# EasyEDA Pro project 22180210-王泽万-项目七.epro

# Schematic Schematic1
Create Date: 2024-05-23; Page Name: P1; Project Name: 项目七金属探测仪; Schematic Name: Schematic1; Update Date: 2024-05-23; Company: 22电子1; Drawed: 22180210王泽万; Page Size: A4; Version: V1.0
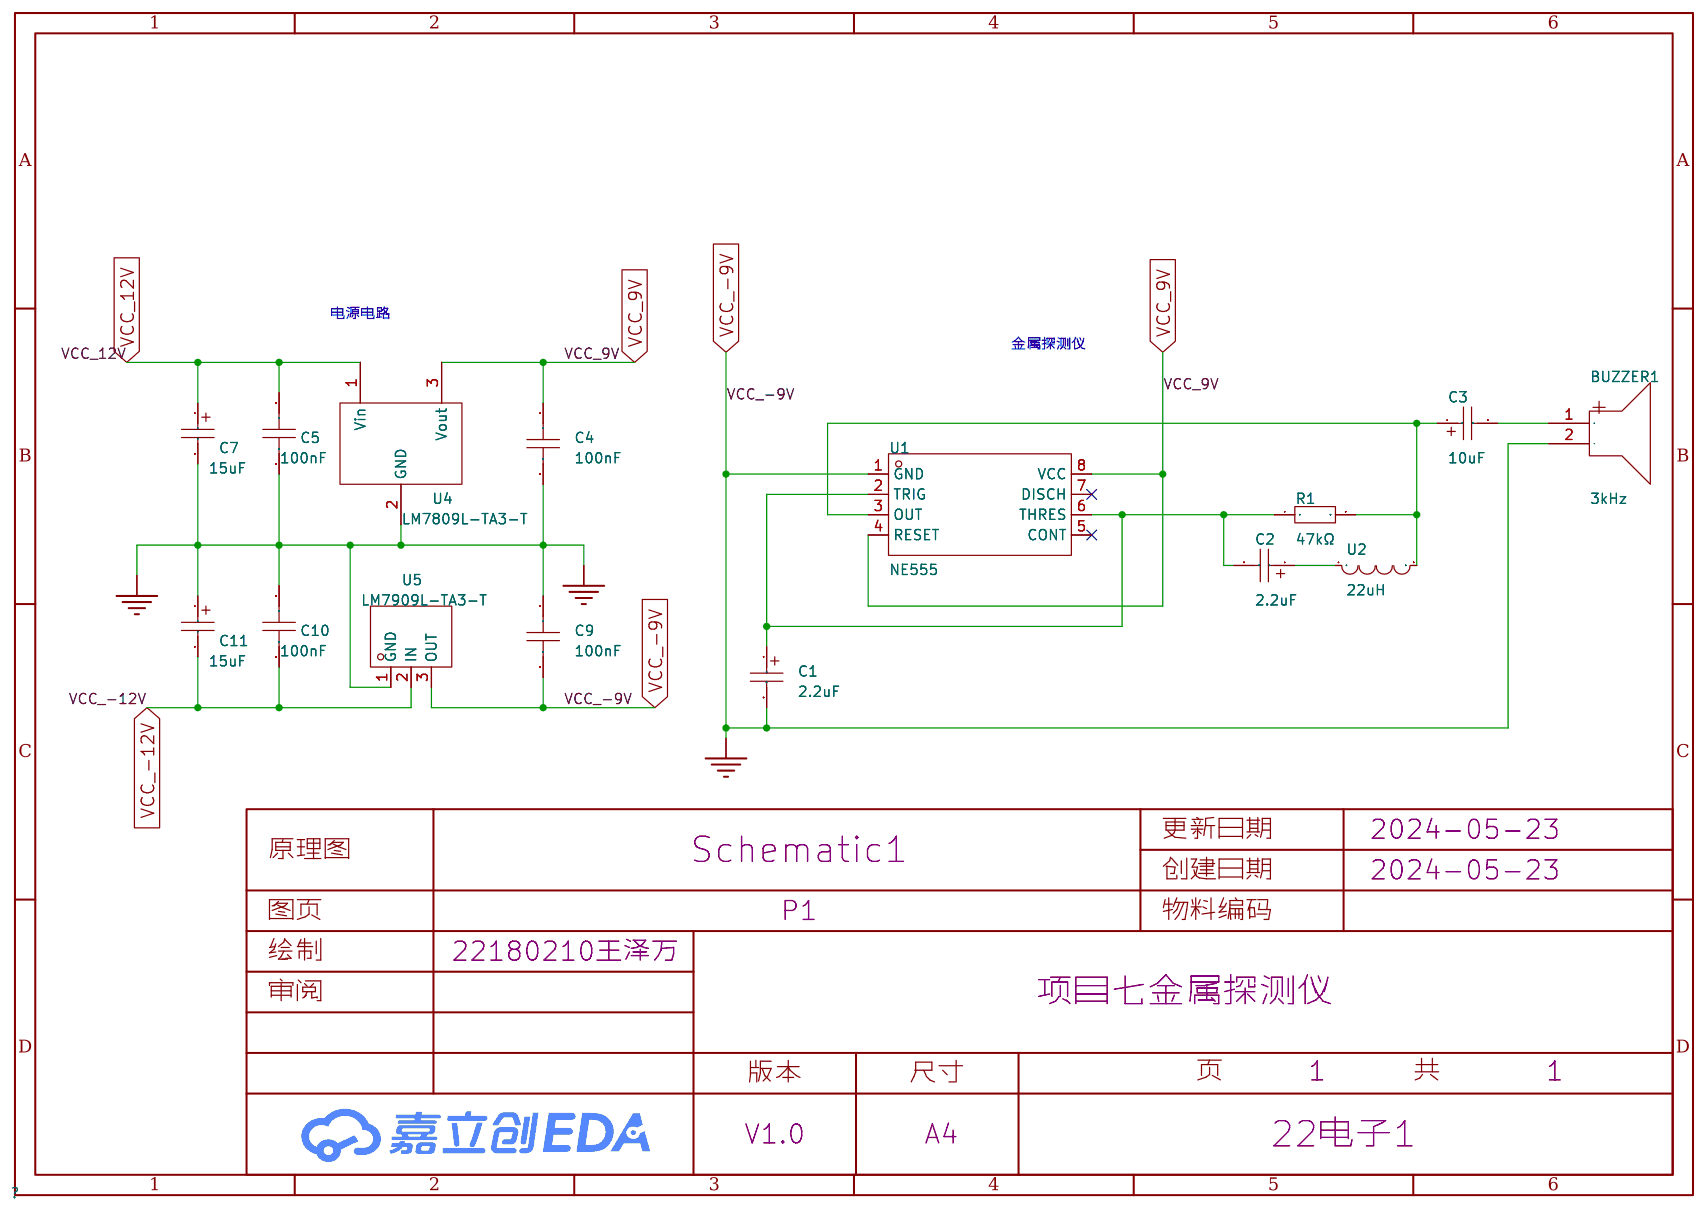
[diagram p0: schematic sheet]

## Parts
BUZZER1  3kHz  [BUZ-TH_BD9.0-P5.00-D0.6-FD]
C1  2.2uF  [C_Ele_SMD_3x5.4mm]
C2  2.2uF  [C_Ele_SMD_3x5.4mm]
C3  10uF  [C_Ele_SMD_3x5.4mm]
C4  100nF  [C0603]
C5  100nF  [C0603]
C7  15uF  [C_Ele_SMD_3x5.4mm]
C9  100nF  [C0603]
C10  100nF  [C0603]
C11  15uF  [C_Ele_SMD_3x5.4mm]
R1  47kΩ  [R0603]
U1  NE555  [SOP-8_L5.0-W4.0-P1.27-LS6.0-BL]
U2  22uH  [IND-TH_L16.5-W8.5-P11.00-D1.0]
U4  LM7809L-TA3-T  [TO-220-3_L10.0-W4.5-P2.54-L]
U5  LM7909L-TA3-T  [TO-220-3_L10.0-W4.5-P2.54-L]

## Library data of the parts
BUZZER1 = HNB09A03: 驱动方式:有源(内含驱动线路);构造类型:电磁式;频率:3kHz;声压(SPL):85dB@10cm;; LCSC Part Name: 电磁式有源一体蜂鸣器HNB09A03; Supplier Part: C96102; Manufacturer: 华能; Supplier Footprint: 插件,D=9mm; Datasheet: https://atta.szlcsc.com/upload/public/pdf/source/20170522/1495448326172.pdf; Supplier: LCSC; Oscillator Circuit: 有源(内含驱动线路); Technology Type: 电磁式; Operating Voltage: 1.5V~4.5V; Current Consumption: 30mA; Sound Pressure Level (SPL): 85dB@10cm; Diameter (φD): 9mm; Height: 5.5mm; Operating Temperature: -20℃~+70℃
C1-C3 C7 C11 = C_Ele_SMD_3x5.4mm: Supplier Footprint: SMD,3x5.4mm
C4 C5 C9 C10 = C0603X104K050T: 容值:100nF;精度:±10%;额定电压:50V;材质(温度系数):X7R;; LCSC Part Name: 100nF ±10% 50V; Supplier Part: C187860; Manufacturer: IHHEC(禾伸堂); Supplier Footprint: 0603; JLCPCB Part Class: Extended Part; Datasheet: https://atta.szlcsc.com/upload/public/pdf/source/20180316/B1A881EE882D7AA2911761F448C7BFE2.pdf; Supplier: LCSC; Tolerance: ±10%; Voltage Rated: 50V; Temperature Coefficient: X7R
R1 = 0603WAF4702T5E: 电阻类型:厚膜电阻;阻值:47kΩ;精度:±1%;功率:100mW;最大工作电压:75V;温度系数:±100ppm/℃;; LCSC Part Name: 47kΩ ±1% 100mW 厚膜电阻; Supplier Part: C25819; Manufacturer: UNI-ROYAL(厚声); Supplier Footprint: 0603; Datasheet: https://atta.szlcsc.com/upload/public/pdf/source/20200306/C422600_1E6D84923E4A46A82E41ADD87F860B5C.pdf; Supplier: LCSC; Type: 厚膜电阻; Tolerance: ±1%; Power(Watts): 100mW; Overload Voltage (Max): 75V; Temperature Coefficient: ±100ppm/℃; Operating Temperature Range: -55℃~+155℃
U1 = NE555: Supplier Part: C504549; Supplier Footprint: SOP-8-4.0mm; JLCPCB Part Class: 扩展库; Supplier: LCSC
U2 = SLT050125T220MUB: 电感值:22uH;精度:±20%;额定电流:5A;饱和电流(Isat):-;类型:磁环电感;Q值:-;; LCSC Part Name: 磁环电感 22uH ±20%; Supplier Part: C326010; Manufacturer: Sunltech(韩国顺磁); Supplier Footprint: 插件; JLCPCB Part Class: 扩展库; Datasheet: https://atta.szlcsc.com/upload/public/pdf/source/20181114/C326010_3669DB49017440BC1576DBED373FE03D.pdf; Supplier: LCSC; Tolerance: ±20%; Rated Current: 5A; DC Resistance: 15mΩ; Type: 磁环电感
U4 = LM7809L-TA3-T: 输出类型:固定;最大输入电压:35V;输出电压:9V;最大输出电流:1A;输出极性:正极;; LCSC Part Name: 输入35V 输出9V 1A; Supplier Part: C75512; Manufacturer: UTC(友顺); Supplier Footprint: TO-220; Datasheet: https://atta.szlcsc.com/upload/public/pdf/source/20160620/1466410513906.pdf; Supplier: LCSC; Output Type: 固定; Maximum Input Voltage: 35V; Output Voltage: 9V; MAX Output Current: 1A; Dropout Voltage: 2V; Output Polarity: 正极; Number of Outputs: 1
U5 = LM7909L-TA3-T: 输出类型:固定;最大输入电压:26V;输出电压:9V;最大输出电流:1A;电源纹波抑制比(PSRR):60dB@(120Hz);输出极性:负极;; LCSC Part Name: 输入26V 输出9V 1A; Supplier Part: C427635; Manufacturer: UTC(友顺); Supplier Footprint: TO-220; Datasheet: https://atta.szlcsc.com/upload/public/pdf/source/20190918/C428906_939899B9567A2FBBAFCB1D90D2F04407.pdf; Supplier: LCSC; Output Type: 固定; Maximum Input Voltage: 26V; Output Voltage: 9V; MAX Output Current: 1A; Power Supply Rejection Ratio (PSRR): 60dB@(120Hz); Dropout Voltage: 2V@(1A); Output Polarity: 负极; Number of Outputs: 1

## Nets
GND: C4.2 C5.2 C7.2 C9.1 C10.1 C11.1 U4.2(GND) U5.1(GND)
VCC_9V: C4.1 U1.4(RESET) U1.8(VCC) U4.3(Vout)
VCC_12V: C5.1 C7.1 U4.1(Vin)
VCC_-9V: BUZZER1.2(-) C1.2 C9.2 U1.1(GND) U5.3(OUT)
VCC_-12V: C10.2 C11.2 U5.2(IN)
$1N653: BUZZER1.1(+) C3.2
$1N836: C2.1 U2.1
$1N860: C3.1 R1.2 U1.3(OUT) U2.2
$1N1027: C1.1 C2.2 R1.1 U1.2(TRIG) U1.6(THRES)

Not connected (* = marked no-connect by the designer): U1 5(CONT)* 7(DISCH)*

## Notes on the sheet
- 电源电路
- 金属探测仪

# Board PCB1
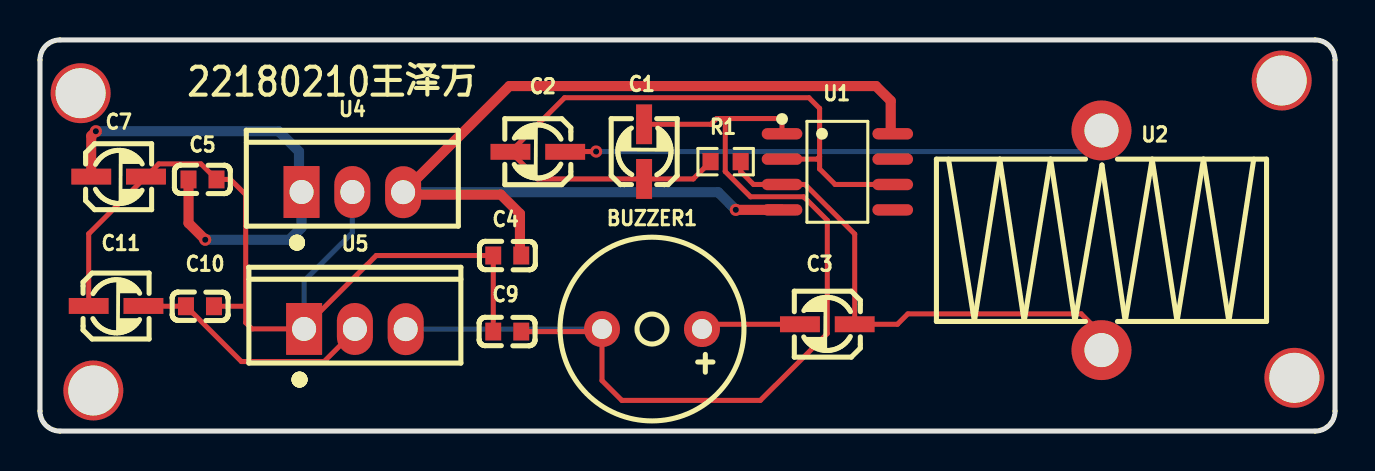
[diagram p1: board, top side]
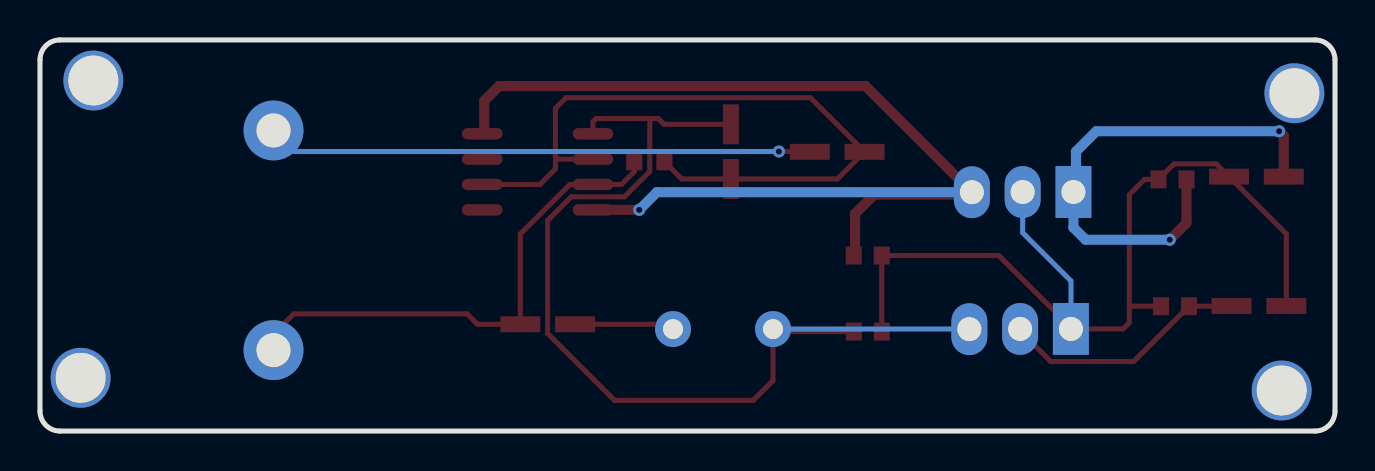
[diagram p2: board, bottom side, seen from below]

Outline 64.77 x 19.59 mm; copper layers: Top Layer, Bottom Layer. Coordinates in mm from the lower left corner of the outline.
Outline path: 0,18.59 0,1 arc(0.29,0.29) 1,0 63.77,0 arc(64.47,0.29) 64.77,1 64.77,18.59 arc(64.47,19.29) 63.77,19.59 1,19.59 arc(0.29,19.29) 0,18.59
Stack: Top Layer 0.035mm / Dielectric1 1.51mm FR4 er 4.5 / Bottom Layer 0.035mm

## Design rules (mm)
template: 自定义配置
spacing copperThickness1oz (default): track to track 0.102, other pairs 0.152 to 0.3
spacing copperThickness2oz: track to track 0.203, other pairs 0.152 to 0.3
track width copperThickness1oz (default): min 0.127, default 0.254, max 2.54
track width copperThickness2oz: min 0.203, default 0.254, max 2.54
track width VCC: min 0.127, default 0.508, max 2.54
differential pair differentialPair (default): width min 0.127, default 0.254, max 2.54; gap min 0.152, default 0.152
via viaSize (default): diameter min 0.5, default 0.61, max 10; hole min 0.3, default 0.305, max 6.299
net VCC_9V uses VCC
net VCC_12V uses VCC

## Placement (name value [footprint] x y rotation side)
BUZZER1  3kHz  [BUZ-TH_BD9.0-P5.00-D0.6-FD]  30.61 5.11 180 top
C1  2.2uF  [C_Ele_SMD_3x5.4mm]  30.23 14 270 top
C2  2.2uF  [C_Ele_SMD_3x5.4mm]  24.89 14 0 top
C3  10uF  [C_Ele_SMD_3x5.4mm]  39.37 5.36 0 top
C4  100nF  [C0603]  23.37 8.79 180 top
C5  100nF  [C0603]  8.13 12.6 0 top
C7  15uF  [C_Ele_SMD_3x5.4mm]  3.94 12.73 180 top
C9  100nF  [C0603]  23.37 4.98 0 top
C10  100nF  [C0603]  8 6.25 180 top
C11  15uF  [C_Ele_SMD_3x5.4mm]  3.81 6.25 180 top
NOREF  -  [Pad_e27]  2.03 16.92 0 top
NOREF#2  -  [Pad_e31]  62.1 17.55 270 top
NOREF#3  -  [Pad_e29]  2.67 2.03 90 top
NOREF#4  -  [Pad_e30]  62.73 2.67 180 top
R1  47kΩ  [R0603]  34.29 13.49 0 top
U1  NE555  [sop-8_l5.0-w4.0-p1.27-ls6.0-bl]  39.88 12.98 270 top
U2  22uH  [IND-TH_L16.5-W8.5-P11.00-D1.0]  53.09 9.55 270 top
U4  LM7809L-TA3-T  [TO-220-3_L10.0-W4.5-P2.54-L]  15.62 11.97 0 top
U5  LM7909L-TA3-T  [TO-220-3_L10.0-W4.5-P2.54-L]  15.75 5.11 0 top

## Footprints (pads in the part's own frame, mm; a bottom-side part is the same pattern mirrored in y, then rotated)
BUZ-TH_BD9.0-P5.00-D0.6-FD
  round 1.8 hole 1: 1(-2.5,0) 2(2.5,0)
C0603
  rect 0.8x0.9 smd: 1(-0.7,0) 2(0.7,0)
C_Ele_SMD_3x5.4mm
  rect 1.999x0.8 smd: 1(1.374,-0.014) 2(-1.364,-0.014)
IND-TH_L16.5-W8.5-P11.00-D1.0
  round 3 hole 1.7: 1(-5.5,0) 2(5.5,0)
Pad_e27
  round 3 hole 2.5: 9(0,0)
Pad_e29
  round 3 hole 2.5: 9(0,0)
Pad_e30
  round 3 hole 2.5: 9(0,0)
Pad_e31
  round 3 hole 2.5: 9(0,0)
R0603
  rect 0.806x0.864 smd: 1(-0.753,0) 2(0.753,0)
sop-8_l5.0-w4.0-p1.27-ls6.0-bl
  oval 0.574x2.035 smd: 1(-1.905,-2.768) 2(-0.635,-2.768) 3(0.635,-2.768) 4(1.905,-2.768) 5(1.905,2.768) 6(0.635,2.768) 7(-0.635,2.768) 8(-1.905,2.768)
TO-220-3_L10.0-W4.5-P2.54-L
  rect 1.8x2.6 hole 1.2: 1(-2.54,0.005)
  oval 1.8x2.6 hole 1.2: 2(0,0.005) 3(2.54,-0.005)

## Nets
As in the schematic.

Pads without a net: NOREF 9; NOREF#2 9; NOREF#3 9; NOREF#4 9; U1 5 7

## Via types
v1: diameter 0.61, hole 0.305, Top Layer to Bottom Layer, 4 vias

## Routing (per net, layer and track width the routed paths; a pad name or vN(x,y) marks a point on that pad's centre or on a via; arc(x,y) is an arc through that point)
GND: length 47.3
  Top Layer w0.254: 2.44,6.27 2.44,9.88 C7.2 5.94,13.38 8.05,13.38 C5.2 9.52,12.6 10.29,11.84 10.29,6.24 ; 22.67,4.98 22.67,8.79 16.82,8.79 13.21,5.18 13.21,5.11 10.6,5.11 10.29,5.43 10.29,6.24 ; 10.29,6.24 10.28,6.25 C10.1
  Bottom Layer w0.254: U4.2 15.62,9.93 13.21,7.52 13.21,5.11
VCC_9V: length 56.3
  Top Layer w0.508: v1(34.8,11.08) U1.4 ; U1.8 42.55,14.99 42.55,16.54 41.81,17.28 23.48,17.28 U4.3 18.28,11.84 23.05,11.84 24,10.88 24,8.87 24.07,8.8 C4.1
  Bottom Layer w0.508: U4.3 33.91,11.96 v1(34.8,11.08)
VCC_12V: length 25.2
  Top Layer w0.508: C5.1 7.43,10.42 v1(8.26,9.58) ; C7.1 2.56,14.78 v1(2.79,15.01)
  Bottom Layer w0.508: v1(8.26,9.58) 12.47,9.58 13.08,10.19 U4.1 12.95,12.1 12.95,14 11.94,15.01 v1(2.79,15.01)
VCC_-9V: length 51.6
  Top Layer w0.254: U1.1 37.11,15.5 36.96,15.65 34.27,15.65 ; 28.11,4.98 C9.2 ; 28.11,4.98 BUZZER1.2 ; 28.11,4.98 28.11,2.53 29.1,1.53 36.02,1.53 39.37,4.89 39.37,10.55 38.19,11.73 35.54,11.73 34.27,13 34.27,15.64 34.27,15.65 ; 34.27,15.65 33.84,15.65 33.55,15.36 C1.2
  Bottom Layer w0.254: BUZZER1.2 18.29,5.11 U5.3
VCC_-12V: length 12.5
  Top Layer w0.254: U5.2 15.75,5.02 14.21,3.48 10.07,3.48 C10.2 5.19,6.25 C11.2
$1N653: length 5
  Top Layer w0.254: BUZZER1.1 33.35,5.35 C3.2
$1N836: length 27.3
  Top Layer w0.254: v1(27.81,14) 26.28,14 C2.1
  Bottom Layer w0.254: U2.1 52.03,14 v1(27.81,14)
$1N860: length 25.8
  Top Layer w0.254: U2.2 53.09,4.85 52.07,5.87 43.4,5.87 42.88,5.35 C3.1 40.74,9.87 38.26,12.35 U1.3 35.69,12.35 35.04,12.99 R1.2
$1N1027: length 36.7
  Top Layer w0.254: 38.99,13.74 38.99,13.13 39.77,12.35 U1.6 ; 38.99,13.74 38.99,16.16 38.45,16.69 26.24,16.69 C2.2 24.89,12.62 C1.1 32.67,12.62 R1.1 ; 38.99,13.74 38.86,13.62 U1.2

## Text on the board
Top Silkscreen Layer: 22180210王泽万
